# EAGLE schematic PDNode-600 Pro1 (EAGLE 9.2.1), part 2 of 3
## Sheet 12 of 15: USB-C PD SOURCE PORT5
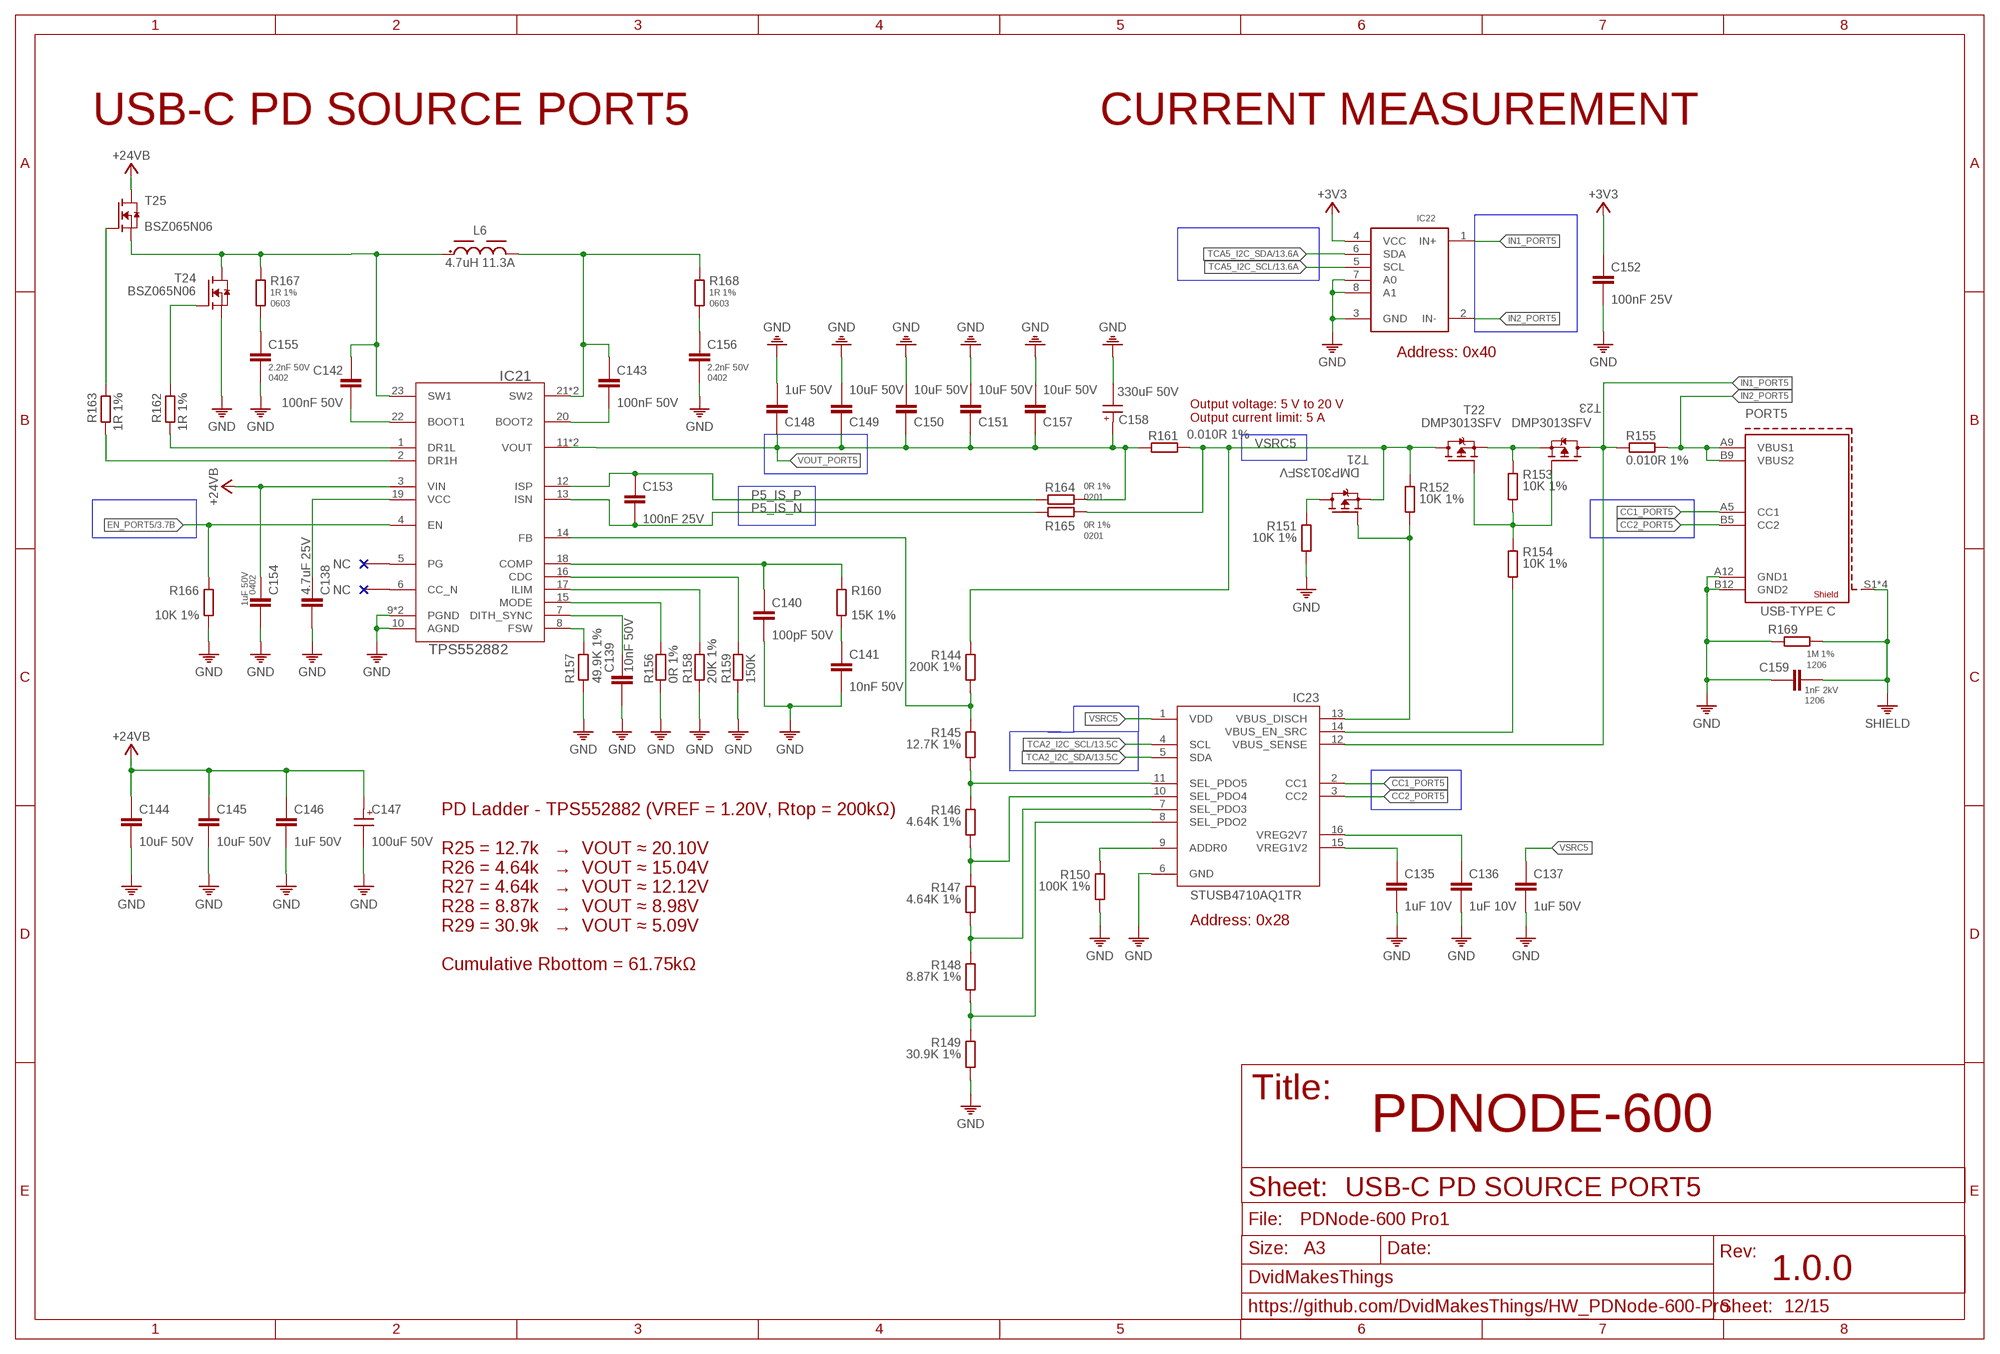
[diagram p11: schematic, sheet 12]

### Parts
C135  1uF 10V  1UF-10V0201  [0201]
C136  1uF 10V  1UF-10V0201  [0201]
C137  1uF 50V  1UF-50V0603  [0603]
C138  4.7uF 25V  4.7UF-25V0402  [0402]
C139  10nF 50V  10NF-50V-0201  [0201]
C140  100pF 50V  100PF-50V0201  [0201]
C141  10nF 50V  10NF-50V-0201  [0201]
C142  100nF 50V  100NF-50V-0402  [0402]
C143  100nF 50V  100NF-50V-0402  [0402]
C144  10uF 50V  10UF-50V-0805  [0805]
C145  10uF 50V  10UF-50V-0805  [0805]
C146  1uF 50V  1UF-50V0805  [0805]
C147  100uF 50V  100UF-50V6.3X7.7(DXL)  [6.3X7.7(DXL)]
C148  1uF 50V  1UF-50V0402  [0402]
C149  10uF 50V  10UF-50V-0805  [0805]
C150  10uF 50V  10UF-50V-0805  [0805]
C151  10uF 50V  10UF-50V-0805  [0805]
C152  100nF 25V  100NF-25V-0201  [0201]
C153  100nF 25V  100NF-25V-0201  [0201]
C154  1uF 50V  1UF-50V0402  [0402]
C155  2.2nF 50V  2.2NF-50V-0402  [0402]
C156  2.2nF 50V  2.2NF-50V-0402  [0402]
C157  10uF 50V  10UF-50V-0805  [0805]
C158  330uF 50V  330UF-50V10X10.5(DXL)  [10X10.5(DXL)]
C159  1nF 2kV  1NF-2KV  [1206]
IC21  TPS552882  [RPM0026A-MFG]
IC22  INA219BIDCNT  [SOT23-8]
IC23  STUSB4710AQ1TR  [QFN50P300X300X55-16N]
L6  4.7uH 11.3A  4.7UH-PWR  [WE-PDHV_1280]
PORT5  632722100213  USB-C-POWERONLY  [632722100213]
R144  200K 1%  200K-1%0201  [0201]
R145  12.7K 1%  12.7K-1%0201  [0201]
R146  4.64K 1%  4.64K-1%-0201  [0201]
R147  4.64K 1%  4.64K-1%-0201  [0201]
R148  8.87K 1%  8.87K-1%-0201  [0201]
R149  30.9K 1%  30.9K-1%0201  [0201]
R150  100K 1%  100K-1%0201  [0201]
R151  10K 1%  10K-1%0402  [0402]
R152  10K 1%  10K-1%0402  [0402]
R153  10K 1%  10K-1%0201  [0201]
R154  10K 1%  10K-1%0402  [0402]
R155  0.010R 1%  0.010R-1%-2512  [2512]
R156  0R 1%  0R0201  [0201]
R157  49.9K 1%  49.9K-1%0201  [0201]
R158  20K 1%  20K-1%0201  [0201]
R159  150K  R0201  [R0201]
R160  15K 1%  15K-1%0201  [0201]
R161  0.010R 1%  0.010R-1%-2512  [2512]
R162  1R 1%  1R-1%0402  [0402]
R163  1R 1%  1R-1%0402  [0402]
R164  0R 1%  0R0201  [0201]
R165  0R 1%  0R0201  [0201]
R166  10K 1%  10K-1%0201  [0201]
R167  1R 1%  1R-1%0603  [0603]
R168  1R 1%  1R-1%0603  [0603]
R169  1M 1%  1M-1%1206  [1206]
T21  DMP3013SFV  DMP3013SFV-7UX  [POWERDI3333-8_UX_DIO-L]
T22  DMP3013SFV  DMP3013SFV-7UX  [POWERDI3333-8_UX_DIO-L]
T23  DMP3013SFV  DMP3013SFV-7UX  [POWERDI3333-8_UX_DIO-L]
T24  BSZ065N06  IPZ40N04S5L7R4ATMA1  [POWERDI3333-8_UX_DIO-L]
T25  BSZ065N06  IPZ40N04S5L7R4ATMA1  [POWERDI3333-8_UX_DIO-L]

### Nets
+3V3: C152.1 IC22.4(VCC) ; also sheet 1,2,3,4,5,6,7,8,9,10,11,13,14,15
+24V_B: C144.1 C145.1 C146.1 C147.1(+) C154.1 IC21.3(VIN) T25.5(D) T25.6(D) T25.7(D) T25.8(D) T25.9(D) ; supply symbol labelled +24VB ; also sheet 5,13,14,15
CC1_PORT5: IC23.2(CC1) PORT5.A5(CC1)
CC2_PORT5: IC23.3(CC2) PORT5.B5(CC2)
DISCHARGE5: R151.1 T21.5(D) T21.6(D) T21.7(D) T21.8(D) T21.9(D)
EN_PORT5: IC21.4(EN) R166.1 ; also sheet 3
GND: C135.2 C136.2 C137.2 C138.2 C139.2 C140.2 C141.2 C144.2 C145.2 C146.2 C147.2(-) C148.2 C149.2 C150.2 C151.2 C152.2 C154.2 C155.2 C156.2 C157.2 C158.2(-) C159.1 IC21.9(PGND) IC21.10(AGND) IC21.24(PGND) IC22.3(GND) IC22.7(A0) IC22.8(A1) IC23.6(GND) PORT5.A12(GND1) PORT5.B12(GND2) R149.2 R150.2 R151.2 R156.2 R157.2 R158.2 R159.2 R166.2 R169.1 T24.1(S) T24.2(S) T24.3(S) ; also sheet 1,2,3,4,5,6,7,8,9,10,11,13,14,15
IN1_PORT5: IC22.1(IN+) IC23.12(VBUS_SENSE) R155.1 T23.5(D) T23.6(D) T23.7(D) T23.8(D) T23.9(D)
IN2_PORT5: IC22.2(IN-) PORT5.A9(VBUS1) PORT5.B9(VBUS2) R155.2
IND5: C142.1 IC21.23(SW1) L6.1 R167.1 T24.5(D) T24.6(D) T24.7(D) T24.8(D) T24.9(D) T25.1(S) T25.2(S) T25.3(S)
INDOUT5: C143.1 IC21.21(SW2) IC21.25(SW2) L6.2 R168.1
N$155: IC23.11(SEL_PDO5) R145.2 R146.1
N$156: IC23.10(SEL_PDO4) R146.2 R147.1
N$157: IC23.7(SEL_PDO3) R147.2 R148.1
N$158: IC23.8(SEL_PDO2) R148.2 R149.1
N$159: C135.1 IC23.15(VREG1V2)
N$160: C136.1 IC23.16(VREG2V7)
N$161: IC23.9(ADDR0) R150.1
N$163: IC23.13(VBUS_DISCH) R152.2 T21.4(G)
N$165: R153.2 R154.1 T22.4(G) T23.4(G)
N$166: IC23.14(VBUS_EN_SRC) R154.2
N$167: C141.1 R160.2
N$168: IC21.8(FSW) R157.1
N$169: C139.1 IC21.7(DITH_SYNC)
N$170: IC21.15(MODE) R156.1
N$171: IC21.17(ILIM) R158.1
N$172: IC21.16(CDC) R159.1
N$173: C140.1 IC21.18(COMP) R160.1
N$174: C138.1 IC21.19(VCC)
N$177: C142.2 IC21.22(BOOT1)
N$178: C143.2 IC21.20(BOOT2)
N$179: R163.2 T25.4(G)
N$180: R162.2 T24.4(G)
N$181: IC21.1(DR1L) R162.1
N$182: IC21.2(DR1H) R163.1
N$183: IC21.14(FB) R144.2 R145.1
N$184: C155.1 R167.2
N$185: C156.1 R168.2
P5_IS_N [50R_DIFFPAIR]: C153.2 IC21.13(ISN) R165.1
P5_IS_P [50R_DIFFPAIR]: C153.1 IC21.12(ISP) R164.1
SHIELD: C159.2 PORT5.S1(SHIELD1) PORT5.S2(SHIELD1) PORT5.S3(SHIELD1) PORT5.S4(SHIELD1) R169.2 ; also sheet 3,4,6,7,8,9,10,11,13,14,15
SOURCE5: R153.1 T22.1(S) T22.2(S) T22.3(S) T23.1(S) T23.2(S) T23.3(S)
TCA2_I2C_SCL: IC23.4(SCL) ; also sheet 3,13
TCA2_I2C_SDA: IC23.5(SDA) ; also sheet 3,13
TCA5_I2C_SCL: IC22.5(SCL) ; also sheet 3,13,14,15
TCA5_I2C_SDA: IC22.6(SDA) ; also sheet 3,13,14,15
VOUT_PORT5: C148.1 C149.1 C150.1 C151.1 C157.1 C158.1(+) IC21.11(VOUT) IC21.26(VOUT) R161.1 R164.2
VSRC5: C137.1 IC23.1(VDD) R144.1 R152.1 R161.2 R165.2 T21.1(S) T21.2(S) T21.3(S) T22.5(D) T22.6(D) T22.7(D) T22.8(D) T22.9(D)
Unconnected: IC21.5(PG) IC21.6(CC_N)

### Notes on the sheet
- USB-C PD SOURCE PORT5 | CURRENT MEASUREMENT
- Address: 0x40
- Output voltage: 5 V to 20 V
  Output current limit: 5 A
- Address: 0x28
- PD Ladder - TPS552882 (VREF = 1.20V, Rtop = 200kΩ)
  
  R25 = 12.7k   →  VOUT ≈ 20.10V
  R26 = 4.64k   →  VOUT ≈ 15.04V
  R27 = 4.64k   →  VOUT ≈ 12.12V
  R28 = 8.87k   →  VOUT ≈ 8.98V
  R29 = 30.9k   →  VOUT ≈ 5.09V
  
  Cumulative Rbottom = 61.75kΩ
- PDNODE-600
- USB-C PD SOURCE PORT5

## Sheet 13 of 15: USB-C PD SOURCE PORT6
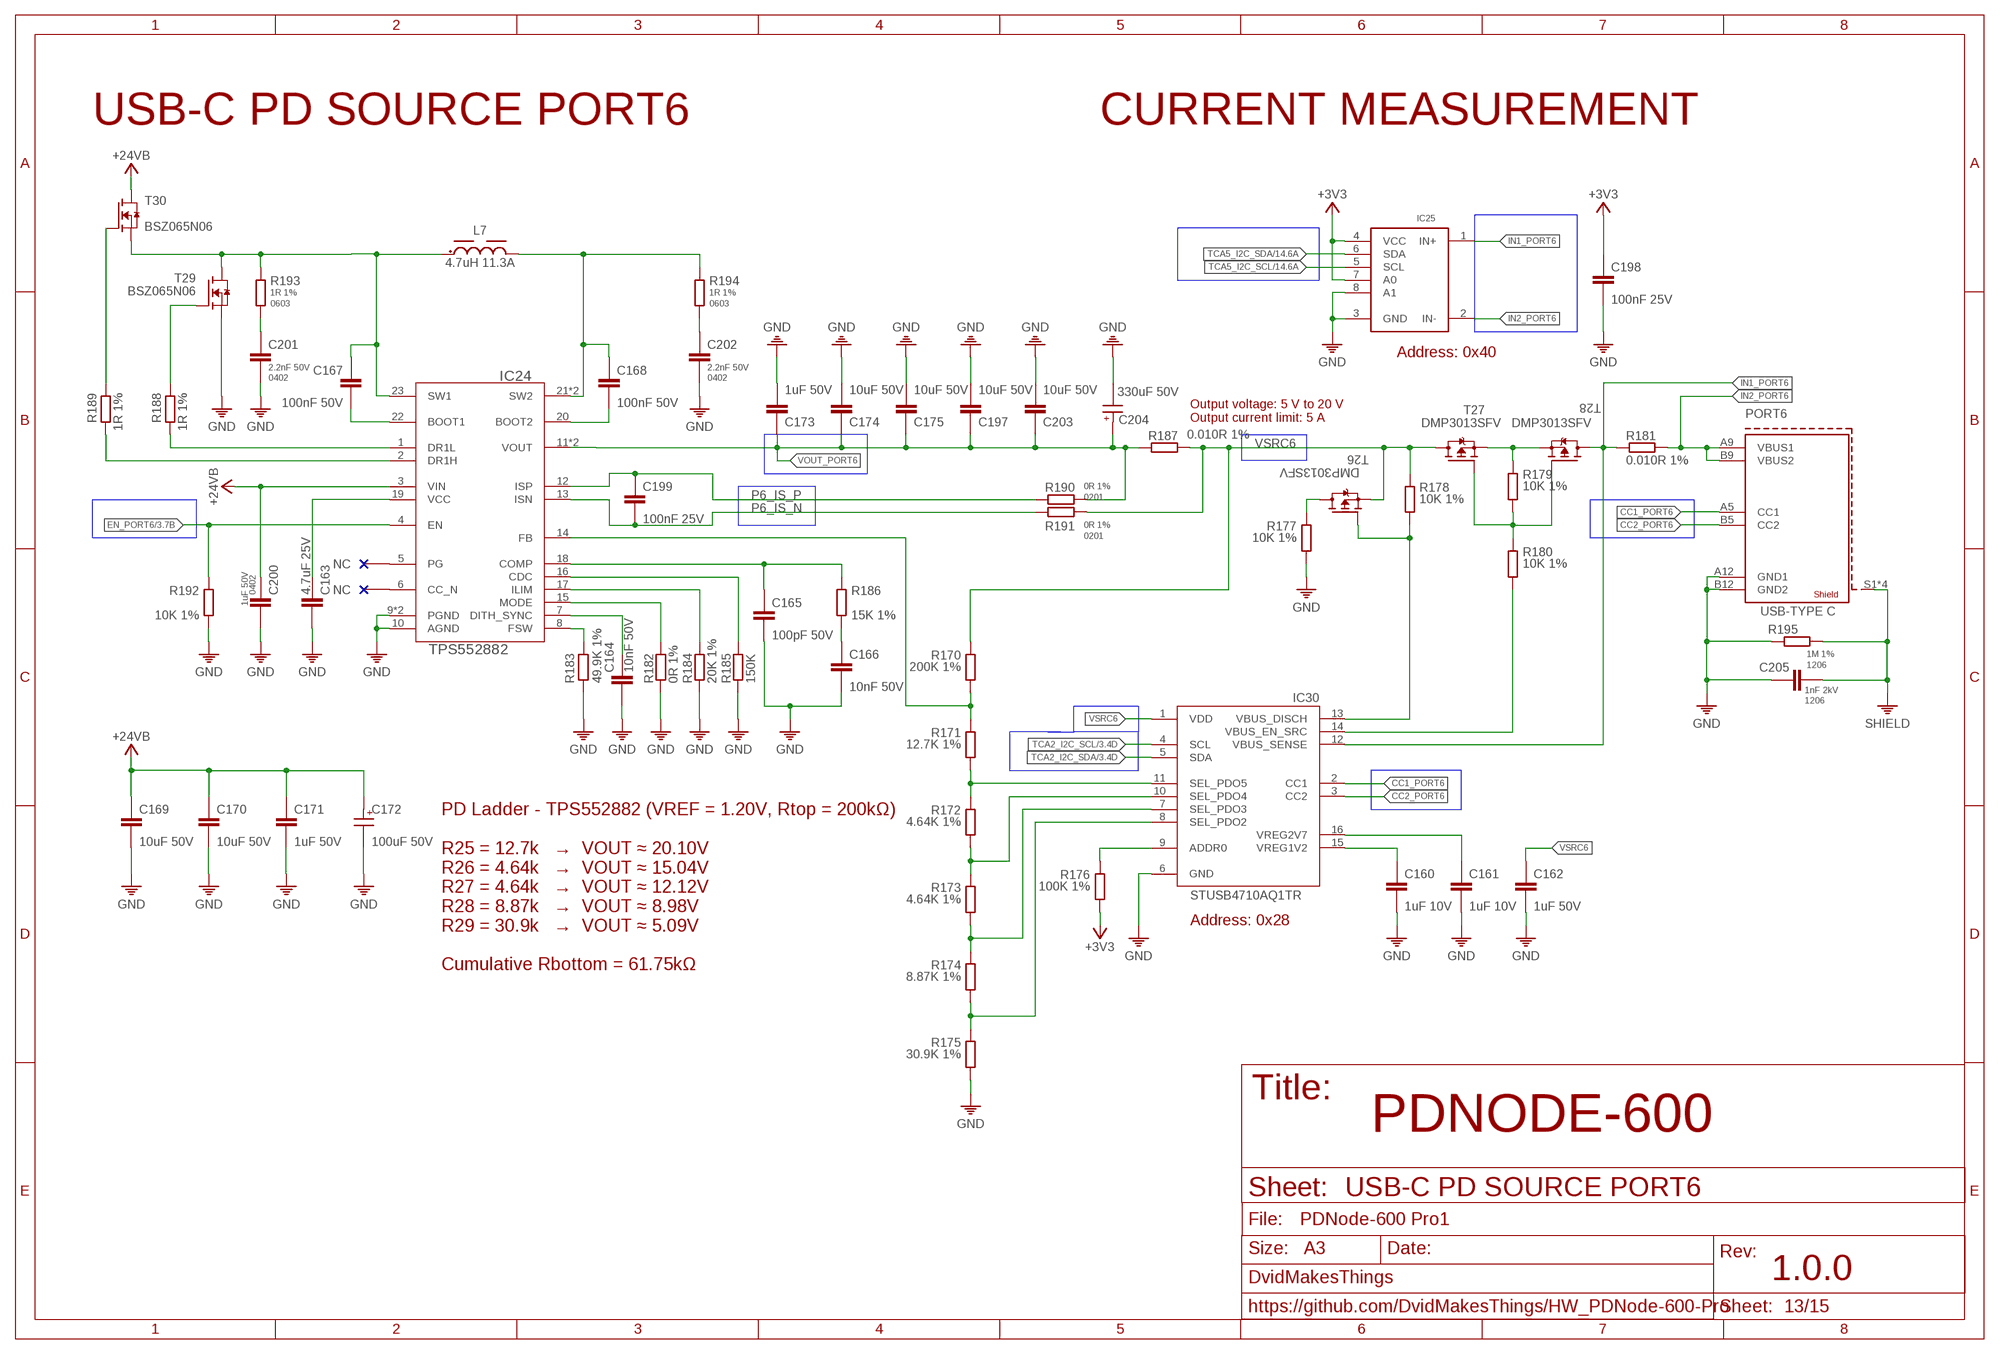
[diagram p12: schematic, sheet 13]

### Parts
C160  1uF 10V  1UF-10V0201  [0201]
C161  1uF 10V  1UF-10V0201  [0201]
C162  1uF 50V  1UF-50V0603  [0603]
C163  4.7uF 25V  4.7UF-25V0402  [0402]
C164  10nF 50V  10NF-50V-0201  [0201]
C165  100pF 50V  100PF-50V0201  [0201]
C166  10nF 50V  10NF-50V-0201  [0201]
C167  100nF 50V  100NF-50V-0402  [0402]
C168  100nF 50V  100NF-50V-0402  [0402]
C169  10uF 50V  10UF-50V-0805  [0805]
C170  10uF 50V  10UF-50V-0805  [0805]
C171  1uF 50V  1UF-50V0805  [0805]
C172  100uF 50V  100UF-50V6.3X7.7(DXL)  [6.3X7.7(DXL)]
C173  1uF 50V  1UF-50V0402  [0402]
C174  10uF 50V  10UF-50V-0805  [0805]
C175  10uF 50V  10UF-50V-0805  [0805]
C197  10uF 50V  10UF-50V-0805  [0805]
C198  100nF 25V  100NF-25V-0201  [0201]
C199  100nF 25V  100NF-25V-0201  [0201]
C200  1uF 50V  1UF-50V0402  [0402]
C201  2.2nF 50V  2.2NF-50V-0402  [0402]
C202  2.2nF 50V  2.2NF-50V-0402  [0402]
C203  10uF 50V  10UF-50V-0805  [0805]
C204  330uF 50V  330UF-50V10X10.5(DXL)  [10X10.5(DXL)]
C205  1nF 2kV  1NF-2KV  [1206]
IC24  TPS552882  [RPM0026A-MFG]
IC25  INA219BIDCNT  [SOT23-8]
IC30  STUSB4710AQ1TR  [QFN50P300X300X55-16N]
L7  4.7uH 11.3A  4.7UH-PWR  [WE-PDHV_1280]
PORT6  632722100213  USB-C-POWERONLY  [632722100213]
R170  200K 1%  200K-1%0201  [0201]
R171  12.7K 1%  12.7K-1%0201  [0201]
R172  4.64K 1%  4.64K-1%-0201  [0201]
R173  4.64K 1%  4.64K-1%-0201  [0201]
R174  8.87K 1%  8.87K-1%-0201  [0201]
R175  30.9K 1%  30.9K-1%0201  [0201]
R176  100K 1%  100K-1%0201  [0201]
R177  10K 1%  10K-1%0402  [0402]
R178  10K 1%  10K-1%0402  [0402]
R179  10K 1%  10K-1%0201  [0201]
R180  10K 1%  10K-1%0402  [0402]
R181  0.010R 1%  0.010R-1%-2512  [2512]
R182  0R 1%  0R0201  [0201]
R183  49.9K 1%  49.9K-1%0201  [0201]
R184  20K 1%  20K-1%0201  [0201]
R185  150K  R0201  [R0201]
R186  15K 1%  15K-1%0201  [0201]
R187  0.010R 1%  0.010R-1%-2512  [2512]
R188  1R 1%  1R-1%0402  [0402]
R189  1R 1%  1R-1%0402  [0402]
R190  0R 1%  0R0201  [0201]
R191  0R 1%  0R0201  [0201]
R192  10K 1%  10K-1%0201  [0201]
R193  1R 1%  1R-1%0603  [0603]
R194  1R 1%  1R-1%0603  [0603]
R195  1M 1%  1M-1%1206  [1206]
T26  DMP3013SFV  DMP3013SFV-7UX  [POWERDI3333-8_UX_DIO-L]
T27  DMP3013SFV  DMP3013SFV-7UX  [POWERDI3333-8_UX_DIO-L]
T28  DMP3013SFV  DMP3013SFV-7UX  [POWERDI3333-8_UX_DIO-L]
T29  BSZ065N06  IPZ40N04S5L7R4ATMA1  [POWERDI3333-8_UX_DIO-L]
T30  BSZ065N06  IPZ40N04S5L7R4ATMA1  [POWERDI3333-8_UX_DIO-L]

### Nets
+3V3: C198.1 IC25.4(VCC) IC25.7(A0) R176.2 ; also sheet 1,2,3,4,5,6,7,8,9,10,11,12,14,15
+24V_B: C169.1 C170.1 C171.1 C172.1(+) C200.1 IC24.3(VIN) T30.5(D) T30.6(D) T30.7(D) T30.8(D) T30.9(D) ; supply symbol labelled +24VB ; also sheet 5,12,14,15
CC1_PORT6: IC30.2(CC1) PORT6.A5(CC1)
CC2_PORT6: IC30.3(CC2) PORT6.B5(CC2)
DISCHARGE6: R177.1 T26.5(D) T26.6(D) T26.7(D) T26.8(D) T26.9(D)
EN_PORT6: IC24.4(EN) R192.1 ; also sheet 3
GND: C160.2 C161.2 C162.2 C163.2 C164.2 C165.2 C166.2 C169.2 C170.2 C171.2 C172.2(-) C173.2 C174.2 C175.2 C197.2 C198.2 C200.2 C201.2 C202.2 C203.2 C204.2(-) C205.1 IC24.9(PGND) IC24.10(AGND) IC24.24(PGND) IC25.3(GND) IC25.8(A1) IC30.6(GND) PORT6.A12(GND1) PORT6.B12(GND2) R175.2 R177.2 R182.2 R183.2 R184.2 R185.2 R192.2 R195.1 T29.1(S) T29.2(S) T29.3(S) ; also sheet 1,2,3,4,5,6,7,8,9,10,11,12,14,15
IN1_PORT6: IC25.1(IN+) IC30.12(VBUS_SENSE) R181.1 T28.5(D) T28.6(D) T28.7(D) T28.8(D) T28.9(D)
IN2_PORT6: IC25.2(IN-) PORT6.A9(VBUS1) PORT6.B9(VBUS2) R181.2
IND6: C167.1 IC24.23(SW1) L7.1 R193.1 T29.5(D) T29.6(D) T29.7(D) T29.8(D) T29.9(D) T30.1(S) T30.2(S) T30.3(S)
INDOUT6: C168.1 IC24.21(SW2) IC24.25(SW2) L7.2 R194.1
N$186: IC30.11(SEL_PDO5) R171.2 R172.1
N$187: IC30.10(SEL_PDO4) R172.2 R173.1
N$188: IC30.7(SEL_PDO3) R173.2 R174.1
N$189: IC30.8(SEL_PDO2) R174.2 R175.1
N$190: C160.1 IC30.15(VREG1V2)
N$191: C161.1 IC30.16(VREG2V7)
N$192: IC30.9(ADDR0) R176.1
N$194: IC30.13(VBUS_DISCH) R178.2 T26.4(G)
N$196: R179.2 R180.1 T27.4(G) T28.4(G)
N$197: IC30.14(VBUS_EN_SRC) R180.2
N$198: C166.1 R186.2
N$199: IC24.8(FSW) R183.1
N$200: C164.1 IC24.7(DITH_SYNC)
N$201: IC24.15(MODE) R182.1
N$202: IC24.17(ILIM) R184.1
N$203: IC24.16(CDC) R185.1
N$204: C165.1 IC24.18(COMP) R186.1
N$205: C163.1 IC24.19(VCC)
N$208: C167.2 IC24.22(BOOT1)
N$209: C168.2 IC24.20(BOOT2)
N$210: R189.2 T30.4(G)
N$211: R188.2 T29.4(G)
N$212: IC24.1(DR1L) R188.1
N$213: IC24.2(DR1H) R189.1
N$214: IC24.14(FB) R170.2 R171.1
N$215: C201.1 R193.2
N$216: C202.1 R194.2
P6_IS_N [50R_DIFFPAIR]: C199.2 IC24.13(ISN) R191.1
P6_IS_P [50R_DIFFPAIR]: C199.1 IC24.12(ISP) R190.1
SHIELD: C205.2 PORT6.S1(SHIELD1) PORT6.S2(SHIELD1) PORT6.S3(SHIELD1) PORT6.S4(SHIELD1) R195.2 ; also sheet 3,4,6,7,8,9,10,11,12,14,15
SOURCE6: R179.1 T27.1(S) T27.2(S) T27.3(S) T28.1(S) T28.2(S) T28.3(S)
TCA2_I2C_SCL: IC30.4(SCL) ; also sheet 3,12
TCA2_I2C_SDA: IC30.5(SDA) ; also sheet 3,12
TCA5_I2C_SCL: IC25.5(SCL) ; also sheet 3,12,14,15
TCA5_I2C_SDA: IC25.6(SDA) ; also sheet 3,12,14,15
VOUT_PORT6: C173.1 C174.1 C175.1 C197.1 C203.1 C204.1(+) IC24.11(VOUT) IC24.26(VOUT) R187.1 R190.2
VSRC6: C162.1 IC30.1(VDD) R170.1 R178.1 R187.2 R191.2 T26.1(S) T26.2(S) T26.3(S) T27.5(D) T27.6(D) T27.7(D) T27.8(D) T27.9(D)
Unconnected: IC24.5(PG) IC24.6(CC_N)

### Notes on the sheet
- USB-C PD SOURCE PORT6 | CURRENT MEASUREMENT
- Address: 0x40
- Output voltage: 5 V to 20 V
  Output current limit: 5 A
- Address: 0x28
- PD Ladder - TPS552882 (VREF = 1.20V, Rtop = 200kΩ)
  
  R25 = 12.7k   →  VOUT ≈ 20.10V
  R26 = 4.64k   →  VOUT ≈ 15.04V
  R27 = 4.64k   →  VOUT ≈ 12.12V
  R28 = 8.87k   →  VOUT ≈ 8.98V
  R29 = 30.9k   →  VOUT ≈ 5.09V
  
  Cumulative Rbottom = 61.75kΩ
- PDNODE-600
- USB-C PD SOURCE PORT6

## Sheet 14 of 15: USB-C PD SOURCE PORT7
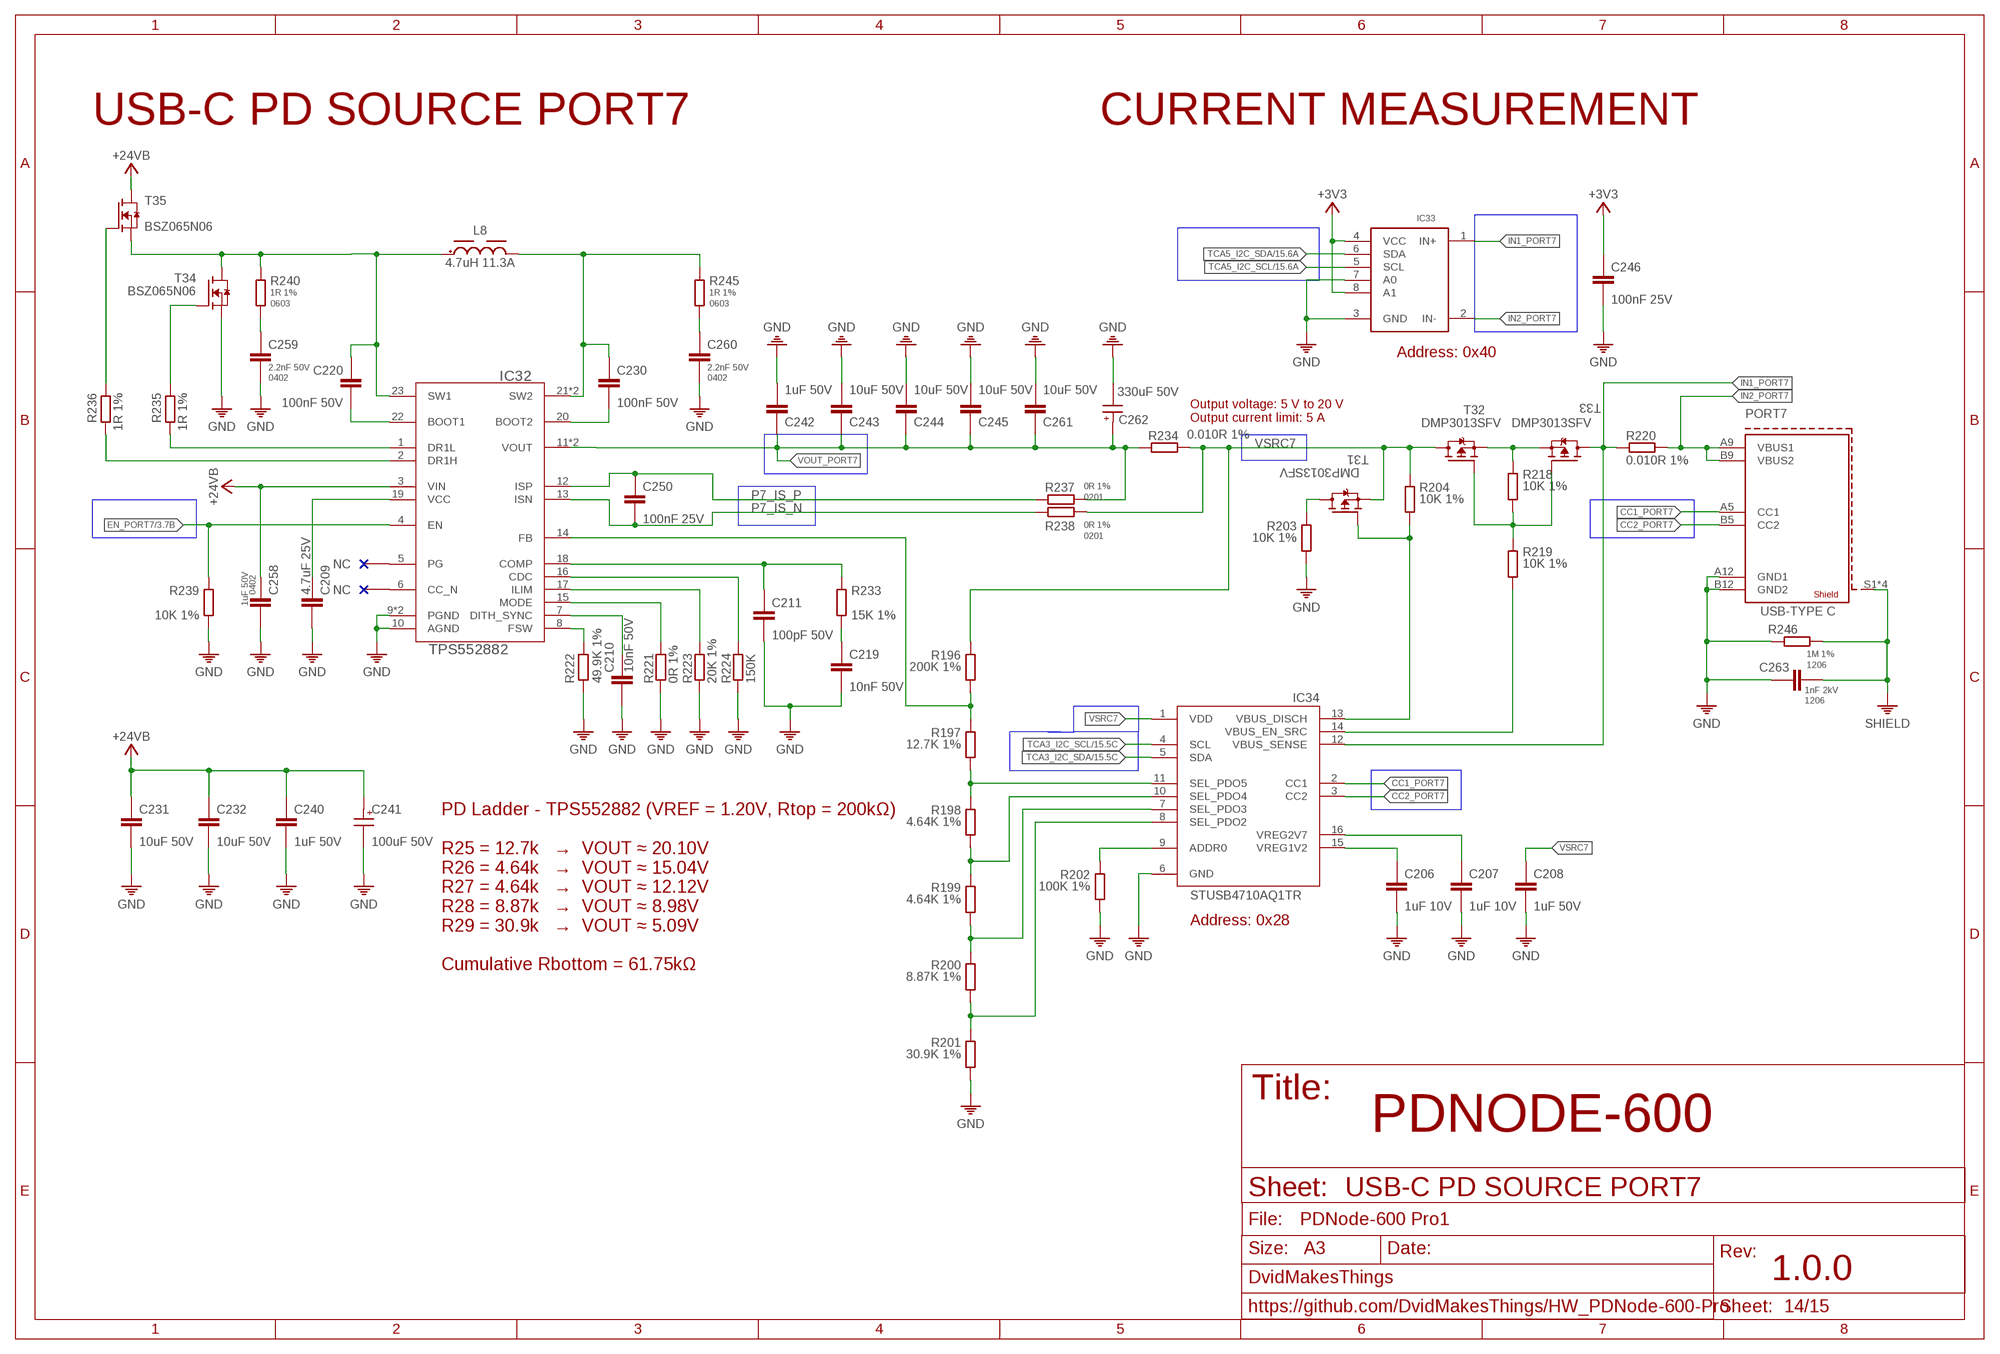
[diagram p13: schematic, sheet 14]

### Parts
C206  1uF 10V  1UF-10V0201  [0201]
C207  1uF 10V  1UF-10V0201  [0201]
C208  1uF 50V  1UF-50V0603  [0603]
C209  4.7uF 25V  4.7UF-25V0402  [0402]
C210  10nF 50V  10NF-50V-0201  [0201]
C211  100pF 50V  100PF-50V0201  [0201]
C219  10nF 50V  10NF-50V-0201  [0201]
C220  100nF 50V  100NF-50V-0402  [0402]
C230  100nF 50V  100NF-50V-0402  [0402]
C231  10uF 50V  10UF-50V-0805  [0805]
C232  10uF 50V  10UF-50V-0805  [0805]
C240  1uF 50V  1UF-50V0805  [0805]
C241  100uF 50V  100UF-50V6.3X7.7(DXL)  [6.3X7.7(DXL)]
C242  1uF 50V  1UF-50V0402  [0402]
C243  10uF 50V  10UF-50V-0805  [0805]
C244  10uF 50V  10UF-50V-0805  [0805]
C245  10uF 50V  10UF-50V-0805  [0805]
C246  100nF 25V  100NF-25V-0201  [0201]
C250  100nF 25V  100NF-25V-0201  [0201]
C258  1uF 50V  1UF-50V0402  [0402]
C259  2.2nF 50V  2.2NF-50V-0402  [0402]
C260  2.2nF 50V  2.2NF-50V-0402  [0402]
C261  10uF 50V  10UF-50V-0805  [0805]
C262  330uF 50V  330UF-50V10X10.5(DXL)  [10X10.5(DXL)]
C263  1nF 2kV  1NF-2KV  [1206]
IC32  TPS552882  [RPM0026A-MFG]
IC33  INA219BIDCNT  [SOT23-8]
IC34  STUSB4710AQ1TR  [QFN50P300X300X55-16N]
L8  4.7uH 11.3A  4.7UH-PWR  [WE-PDHV_1280]
PORT7  632722100213  USB-C-POWERONLY  [632722100213]
R196  200K 1%  200K-1%0201  [0201]
R197  12.7K 1%  12.7K-1%0201  [0201]
R198  4.64K 1%  4.64K-1%-0201  [0201]
R199  4.64K 1%  4.64K-1%-0201  [0201]
R200  8.87K 1%  8.87K-1%-0201  [0201]
R201  30.9K 1%  30.9K-1%0201  [0201]
R202  100K 1%  100K-1%0201  [0201]
R203  10K 1%  10K-1%0402  [0402]
R204  10K 1%  10K-1%0402  [0402]
R218  10K 1%  10K-1%0201  [0201]
R219  10K 1%  10K-1%0402  [0402]
R220  0.010R 1%  0.010R-1%-2512  [2512]
R221  0R 1%  0R0201  [0201]
R222  49.9K 1%  49.9K-1%0201  [0201]
R223  20K 1%  20K-1%0201  [0201]
R224  150K  R0201  [R0201]
R233  15K 1%  15K-1%0201  [0201]
R234  0.010R 1%  0.010R-1%-2512  [2512]
R235  1R 1%  1R-1%0402  [0402]
R236  1R 1%  1R-1%0402  [0402]
R237  0R 1%  0R0201  [0201]
R238  0R 1%  0R0201  [0201]
R239  10K 1%  10K-1%0201  [0201]
R240  1R 1%  1R-1%0603  [0603]
R245  1R 1%  1R-1%0603  [0603]
R246  1M 1%  1M-1%1206  [1206]
T31  DMP3013SFV  DMP3013SFV-7UX  [POWERDI3333-8_UX_DIO-L]
T32  DMP3013SFV  DMP3013SFV-7UX  [POWERDI3333-8_UX_DIO-L]
T33  DMP3013SFV  DMP3013SFV-7UX  [POWERDI3333-8_UX_DIO-L]
T34  BSZ065N06  IPZ40N04S5L7R4ATMA1  [POWERDI3333-8_UX_DIO-L]
T35  BSZ065N06  IPZ40N04S5L7R4ATMA1  [POWERDI3333-8_UX_DIO-L]

### Nets
+3V3: C246.1 IC33.4(VCC) IC33.8(A1) ; also sheet 1,2,3,4,5,6,7,8,9,10,11,12,13,15
+24V_B: C231.1 C232.1 C240.1 C241.1(+) C258.1 IC32.3(VIN) T35.5(D) T35.6(D) T35.7(D) T35.8(D) T35.9(D) ; supply symbol labelled +24VB ; also sheet 5,12,13,15
CC1_PORT7: IC34.2(CC1) PORT7.A5(CC1)
CC2_PORT7: IC34.3(CC2) PORT7.B5(CC2)
DISCHARGE7: R203.1 T31.5(D) T31.6(D) T31.7(D) T31.8(D) T31.9(D)
EN_PORT7: IC32.4(EN) R239.1 ; also sheet 3
GND: C206.2 C207.2 C208.2 C209.2 C210.2 C211.2 C219.2 C231.2 C232.2 C240.2 C241.2(-) C242.2 C243.2 C244.2 C245.2 C246.2 C258.2 C259.2 C260.2 C261.2 C262.2(-) C263.1 IC32.9(PGND) IC32.10(AGND) IC32.24(PGND) IC33.3(GND) IC33.7(A0) IC34.6(GND) PORT7.A12(GND1) PORT7.B12(GND2) R201.2 R202.2 R203.2 R221.2 R222.2 R223.2 R224.2 R239.2 R246.1 T34.1(S) T34.2(S) T34.3(S) ; also sheet 1,2,3,4,5,6,7,8,9,10,11,12,13,15
IN1_PORT7: IC33.1(IN+) IC34.12(VBUS_SENSE) R220.1 T33.5(D) T33.6(D) T33.7(D) T33.8(D) T33.9(D)
IN2_PORT7: IC33.2(IN-) PORT7.A9(VBUS1) PORT7.B9(VBUS2) R220.2
IND7: C220.1 IC32.23(SW1) L8.1 R240.1 T34.5(D) T34.6(D) T34.7(D) T34.8(D) T34.9(D) T35.1(S) T35.2(S) T35.3(S)
INDOUT7: C230.1 IC32.21(SW2) IC32.25(SW2) L8.2 R245.1
N$217: IC34.11(SEL_PDO5) R197.2 R198.1
N$218: IC34.10(SEL_PDO4) R198.2 R199.1
N$219: IC34.7(SEL_PDO3) R199.2 R200.1
N$220: IC34.8(SEL_PDO2) R200.2 R201.1
N$221: C206.1 IC34.15(VREG1V2)
N$223: C207.1 IC34.16(VREG2V7)
N$224: IC34.9(ADDR0) R202.1
N$226: IC34.13(VBUS_DISCH) R204.2 T31.4(G)
N$228: R218.2 R219.1 T32.4(G) T33.4(G)
N$229: IC34.14(VBUS_EN_SRC) R219.2
N$230: C219.1 R233.2
N$231: IC32.8(FSW) R222.1
N$232: C210.1 IC32.7(DITH_SYNC)
N$233: IC32.15(MODE) R221.1
N$234: IC32.17(ILIM) R223.1
N$235: IC32.16(CDC) R224.1
N$236: C211.1 IC32.18(COMP) R233.1
N$237: C209.1 IC32.19(VCC)
N$240: C220.2 IC32.22(BOOT1)
N$241: C230.2 IC32.20(BOOT2)
N$242: R236.2 T35.4(G)
N$243: R235.2 T34.4(G)
N$244: IC32.1(DR1L) R235.1
N$245: IC32.2(DR1H) R236.1
N$246: IC32.14(FB) R196.2 R197.1
N$247: C259.1 R240.2
N$248: C260.1 R245.2
P7_IS_N [50R_DIFFPAIR]: C250.2 IC32.13(ISN) R238.1
P7_IS_P [50R_DIFFPAIR]: C250.1 IC32.12(ISP) R237.1
SHIELD: C263.2 PORT7.S1(SHIELD1) PORT7.S2(SHIELD1) PORT7.S3(SHIELD1) PORT7.S4(SHIELD1) R246.2 ; also sheet 3,4,6,7,8,9,10,11,12,13,15
SOURCE7: R218.1 T32.1(S) T32.2(S) T32.3(S) T33.1(S) T33.2(S) T33.3(S)
TCA3_I2C_SCL: IC34.4(SCL) ; also sheet 3,15
TCA3_I2C_SDA: IC34.5(SDA) ; also sheet 3,15
TCA5_I2C_SCL: IC33.5(SCL) ; also sheet 3,12,13,15
TCA5_I2C_SDA: IC33.6(SDA) ; also sheet 3,12,13,15
VOUT_PORT7: C242.1 C243.1 C244.1 C245.1 C261.1 C262.1(+) IC32.11(VOUT) IC32.26(VOUT) R234.1 R237.2
VSRC7: C208.1 IC34.1(VDD) R196.1 R204.1 R234.2 R238.2 T31.1(S) T31.2(S) T31.3(S) T32.5(D) T32.6(D) T32.7(D) T32.8(D) T32.9(D)
Unconnected: IC32.5(PG) IC32.6(CC_N)

### Notes on the sheet
- USB-C PD SOURCE PORT7 | CURRENT MEASUREMENT
- Address: 0x40
- Output voltage: 5 V to 20 V
  Output current limit: 5 A
- Address: 0x28
- PD Ladder - TPS552882 (VREF = 1.20V, Rtop = 200kΩ)
  
  R25 = 12.7k   →  VOUT ≈ 20.10V
  R26 = 4.64k   →  VOUT ≈ 15.04V
  R27 = 4.64k   →  VOUT ≈ 12.12V
  R28 = 8.87k   →  VOUT ≈ 8.98V
  R29 = 30.9k   →  VOUT ≈ 5.09V
  
  Cumulative Rbottom = 61.75kΩ
- PDNODE-600
- USB-C PD SOURCE PORT7

## Sheet 15 of 15: USB-C PD SOURCE PORT8
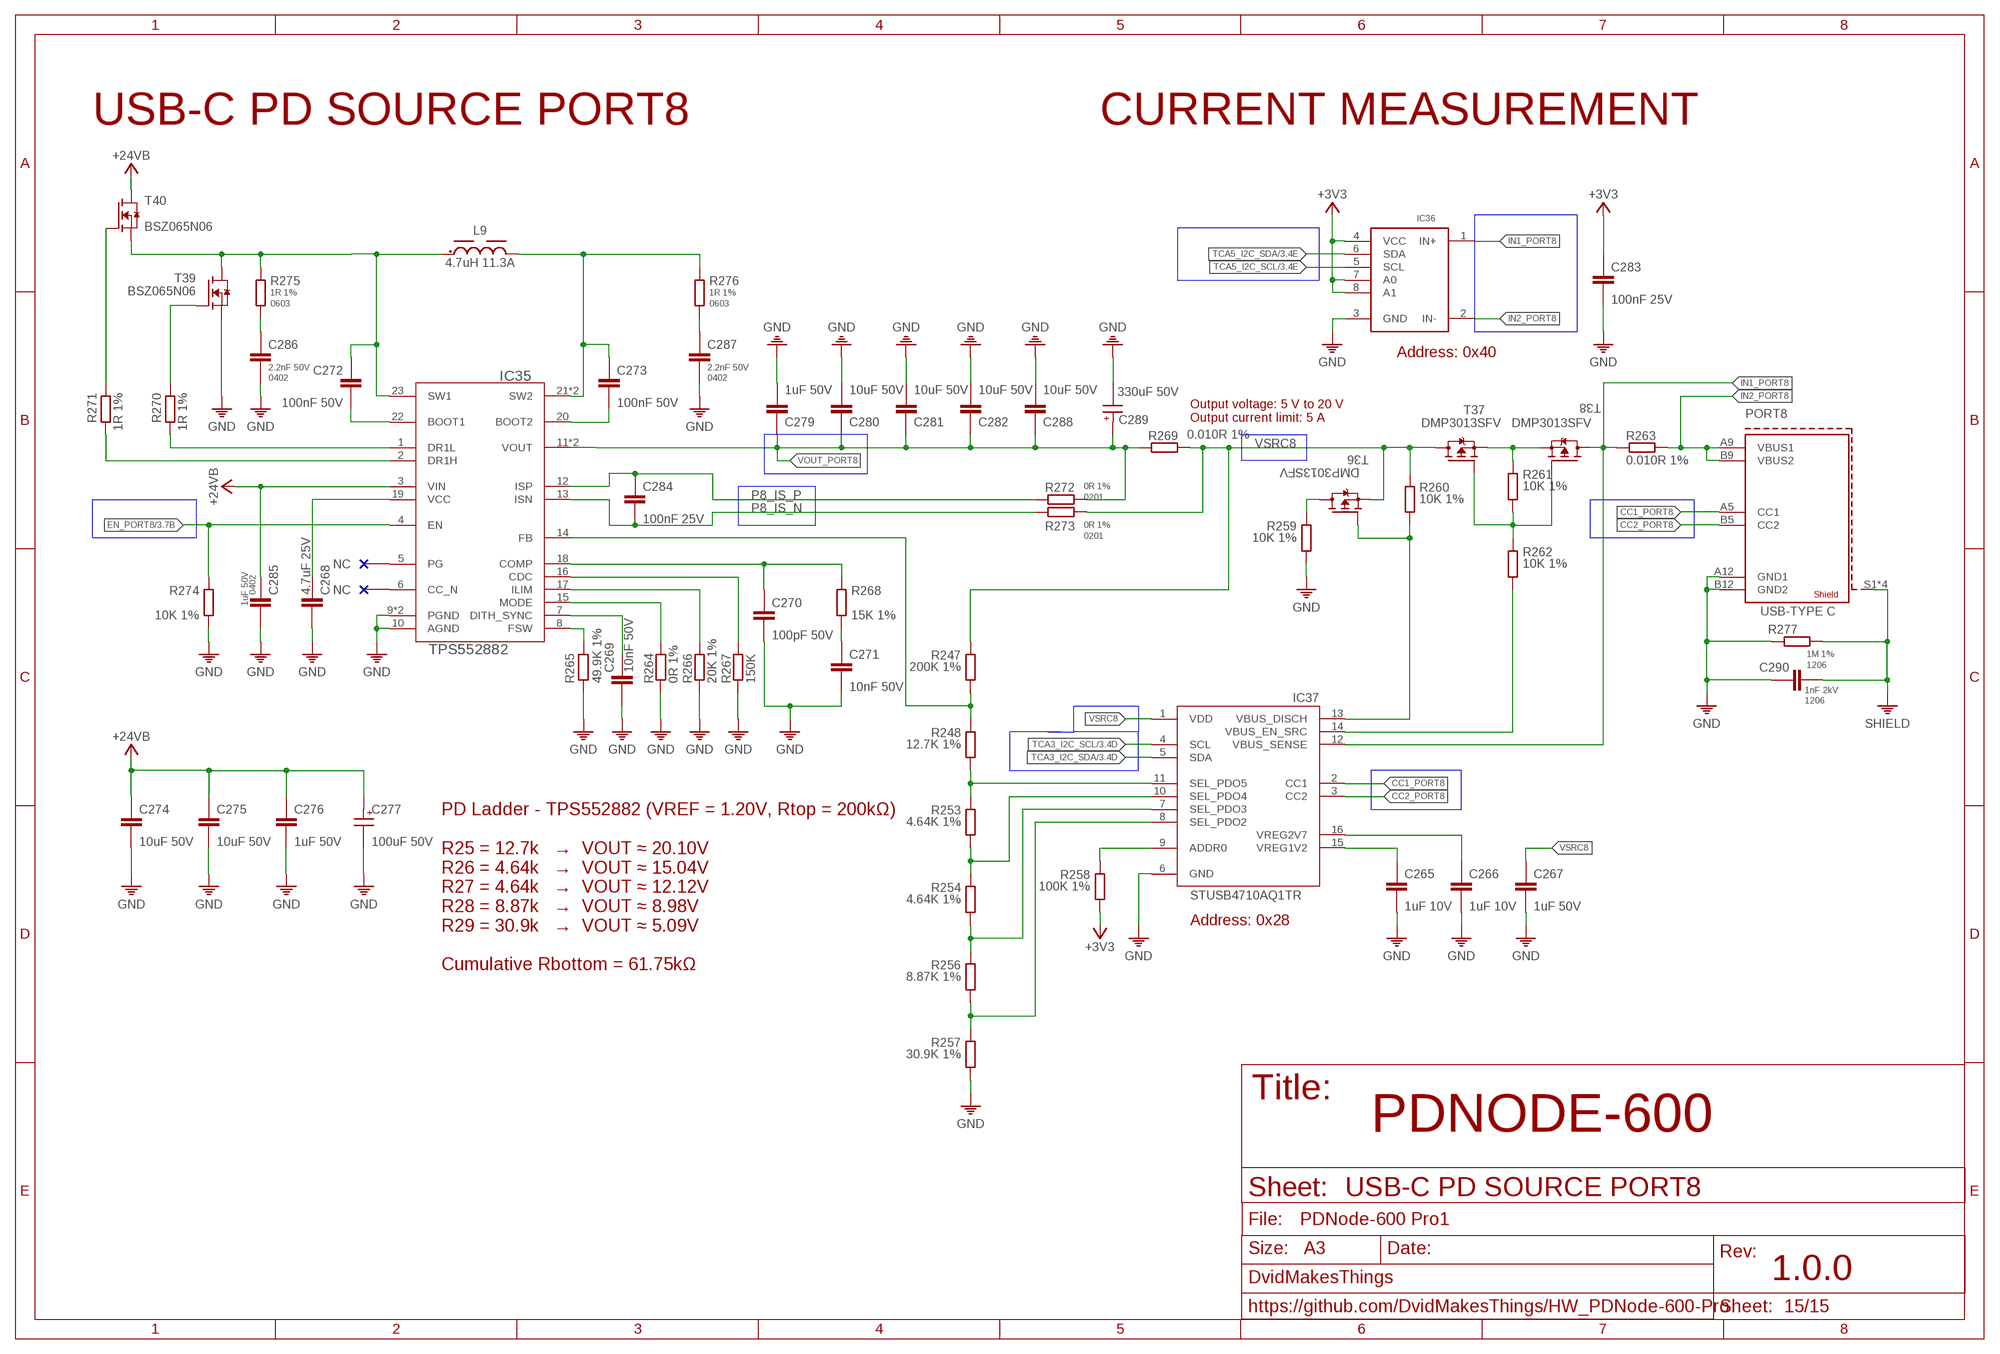
[diagram p14: schematic, sheet 15]

### Parts
C265  1uF 10V  1UF-10V0201  [0201]
C266  1uF 10V  1UF-10V0201  [0201]
C267  1uF 50V  1UF-50V0603  [0603]
C268  4.7uF 25V  4.7UF-25V0402  [0402]
C269  10nF 50V  10NF-50V-0201  [0201]
C270  100pF 50V  100PF-50V0201  [0201]
C271  10nF 50V  10NF-50V-0201  [0201]
C272  100nF 50V  100NF-50V-0402  [0402]
C273  100nF 50V  100NF-50V-0402  [0402]
C274  10uF 50V  10UF-50V-0805  [0805]
C275  10uF 50V  10UF-50V-0805  [0805]
C276  1uF 50V  1UF-50V0805  [0805]
C277  100uF 50V  100UF-50V6.3X7.7(DXL)  [6.3X7.7(DXL)]
C279  1uF 50V  1UF-50V0402  [0402]
C280  10uF 50V  10UF-50V-0805  [0805]
C281  10uF 50V  10UF-50V-0805  [0805]
C282  10uF 50V  10UF-50V-0805  [0805]
C283  100nF 25V  100NF-25V-0201  [0201]
C284  100nF 25V  100NF-25V-0201  [0201]
C285  1uF 50V  1UF-50V0402  [0402]
C286  2.2nF 50V  2.2NF-50V-0402  [0402]
C287  2.2nF 50V  2.2NF-50V-0402  [0402]
C288  10uF 50V  10UF-50V-0805  [0805]
C289  330uF 50V  330UF-50V10X10.5(DXL)  [10X10.5(DXL)]
C290  1nF 2kV  1NF-2KV  [1206]
IC35  TPS552882  [RPM0026A-MFG]
IC36  INA219BIDCNT  [SOT23-8]
IC37  STUSB4710AQ1TR  [QFN50P300X300X55-16N]
L9  4.7uH 11.3A  4.7UH-PWR  [WE-PDHV_1280]
PORT8  632722100213  USB-C-POWERONLY  [632722100213]
R247  200K 1%  200K-1%0201  [0201]
R248  12.7K 1%  12.7K-1%0201  [0201]
R253  4.64K 1%  4.64K-1%-0201  [0201]
R254  4.64K 1%  4.64K-1%-0201  [0201]
R256  8.87K 1%  8.87K-1%-0201  [0201]
R257  30.9K 1%  30.9K-1%0201  [0201]
R258  100K 1%  100K-1%0201  [0201]
R259  10K 1%  10K-1%0402  [0402]
R260  10K 1%  10K-1%0402  [0402]
R261  10K 1%  10K-1%0201  [0201]
R262  10K 1%  10K-1%0402  [0402]
R263  0.010R 1%  0.010R-1%-2512  [2512]
R264  0R 1%  0R0201  [0201]
R265  49.9K 1%  49.9K-1%0201  [0201]
R266  20K 1%  20K-1%0201  [0201]
R267  150K  R0201  [R0201]
R268  15K 1%  15K-1%0201  [0201]
R269  0.010R 1%  0.010R-1%-2512  [2512]
R270  1R 1%  1R-1%0402  [0402]
R271  1R 1%  1R-1%0402  [0402]
R272  0R 1%  0R0201  [0201]
R273  0R 1%  0R0201  [0201]
R274  10K 1%  10K-1%0201  [0201]
R275  1R 1%  1R-1%0603  [0603]
R276  1R 1%  1R-1%0603  [0603]
R277  1M 1%  1M-1%1206  [1206]
T36  DMP3013SFV  DMP3013SFV-7UX  [POWERDI3333-8_UX_DIO-L]
T37  DMP3013SFV  DMP3013SFV-7UX  [POWERDI3333-8_UX_DIO-L]
T38  DMP3013SFV  DMP3013SFV-7UX  [POWERDI3333-8_UX_DIO-L]
T39  BSZ065N06  IPZ40N04S5L7R4ATMA1  [POWERDI3333-8_UX_DIO-L]
T40  BSZ065N06  IPZ40N04S5L7R4ATMA1  [POWERDI3333-8_UX_DIO-L]

### Nets
+3V3: C283.1 IC36.4(VCC) IC36.7(A0) IC36.8(A1) R258.2 ; also sheet 1,2,3,4,5,6,7,8,9,10,11,12,13,14
+24V_B: C274.1 C275.1 C276.1 C277.1(+) C285.1 IC35.3(VIN) T40.5(D) T40.6(D) T40.7(D) T40.8(D) T40.9(D) ; supply symbol labelled +24VB ; also sheet 5,12,13,14
CC1_PORT8: IC37.2(CC1) PORT8.A5(CC1)
CC2_PORT8: IC37.3(CC2) PORT8.B5(CC2)
DISCHARGE8: R259.1 T36.5(D) T36.6(D) T36.7(D) T36.8(D) T36.9(D)
EN_PORT8: IC35.4(EN) R274.1 ; also sheet 3
GND: C265.2 C266.2 C267.2 C268.2 C269.2 C270.2 C271.2 C274.2 C275.2 C276.2 C277.2(-) C279.2 C280.2 C281.2 C282.2 C283.2 C285.2 C286.2 C287.2 C288.2 C289.2(-) C290.1 IC35.9(PGND) IC35.10(AGND) IC35.24(PGND) IC36.3(GND) IC37.6(GND) PORT8.A12(GND1) PORT8.B12(GND2) R257.2 R259.2 R264.2 R265.2 R266.2 R267.2 R274.2 R277.1 T39.1(S) T39.2(S) T39.3(S) ; also sheet 1,2,3,4,5,6,7,8,9,10,11,12,13,14
IN1_PORT8: IC36.1(IN+) IC37.12(VBUS_SENSE) R263.1 T38.5(D) T38.6(D) T38.7(D) T38.8(D) T38.9(D)
IN2_PORT8: IC36.2(IN-) PORT8.A9(VBUS1) PORT8.B9(VBUS2) R263.2
IND8: C272.1 IC35.23(SW1) L9.1 R275.1 T39.5(D) T39.6(D) T39.7(D) T39.8(D) T39.9(D) T40.1(S) T40.2(S) T40.3(S)
INDOUT8: C273.1 IC35.21(SW2) IC35.25(SW2) L9.2 R276.1
N$249: IC37.11(SEL_PDO5) R248.2 R253.1
N$250: IC37.10(SEL_PDO4) R253.2 R254.1
N$251: IC37.7(SEL_PDO3) R254.2 R256.1
N$252: IC37.8(SEL_PDO2) R256.2 R257.1
N$253: C265.1 IC37.15(VREG1V2)
N$254: C266.1 IC37.16(VREG2V7)
N$255: IC37.9(ADDR0) R258.1
N$257: IC37.13(VBUS_DISCH) R260.2 T36.4(G)
N$259: R261.2 R262.1 T37.4(G) T38.4(G)
N$260: IC37.14(VBUS_EN_SRC) R262.2
N$261: C271.1 R268.2
N$262: IC35.8(FSW) R265.1
N$263: C269.1 IC35.7(DITH_SYNC)
N$264: IC35.15(MODE) R264.1
N$265: IC35.17(ILIM) R266.1
N$266: IC35.16(CDC) R267.1
N$272: C270.1 IC35.18(COMP) R268.1
N$273: C268.1 IC35.19(VCC)
N$278: C272.2 IC35.22(BOOT1)
N$279: C273.2 IC35.20(BOOT2)
N$280: R271.2 T40.4(G)
N$281: R270.2 T39.4(G)
N$282: IC35.1(DR1L) R270.1
N$283: IC35.2(DR1H) R271.1
N$284: IC35.14(FB) R247.2 R248.1
N$285: C286.1 R275.2
N$286: C287.1 R276.2
P8_IS_N [50R_DIFFPAIR]: C284.2 IC35.13(ISN) R273.1
P8_IS_P [50R_DIFFPAIR]: C284.1 IC35.12(ISP) R272.1
SHIELD: C290.2 PORT8.S1(SHIELD1) PORT8.S2(SHIELD1) PORT8.S3(SHIELD1) PORT8.S4(SHIELD1) R277.2 ; also sheet 3,4,6,7,8,9,10,11,12,13,14
SOURCE8: R261.1 T37.1(S) T37.2(S) T37.3(S) T38.1(S) T38.2(S) T38.3(S)
TCA3_I2C_SCL: IC37.4(SCL) ; also sheet 3,14
TCA3_I2C_SDA: IC37.5(SDA) ; also sheet 3,14
TCA5_I2C_SCL: IC36.5(SCL) ; also sheet 3,12,13,14
TCA5_I2C_SDA: IC36.6(SDA) ; also sheet 3,12,13,14
VOUT_PORT8: C279.1 C280.1 C281.1 C282.1 C288.1 C289.1(+) IC35.11(VOUT) IC35.26(VOUT) R269.1 R272.2
VSRC8: C267.1 IC37.1(VDD) R247.1 R260.1 R269.2 R273.2 T36.1(S) T36.2(S) T36.3(S) T37.5(D) T37.6(D) T37.7(D) T37.8(D) T37.9(D)
Unconnected: IC35.5(PG) IC35.6(CC_N)

### Notes on the sheet
- USB-C PD SOURCE PORT8 | CURRENT MEASUREMENT
- Address: 0x40
- Output voltage: 5 V to 20 V
  Output current limit: 5 A
- Address: 0x28
- PD Ladder - TPS552882 (VREF = 1.20V, Rtop = 200kΩ)
  
  R25 = 12.7k   →  VOUT ≈ 20.10V
  R26 = 4.64k   →  VOUT ≈ 15.04V
  R27 = 4.64k   →  VOUT ≈ 12.12V
  R28 = 8.87k   →  VOUT ≈ 8.98V
  R29 = 30.9k   →  VOUT ≈ 5.09V
  
  Cumulative Rbottom = 61.75kΩ
- PDNODE-600
- USB-C PD SOURCE PORT8